# EAGLE board starduino (EAGLE 6.5.0), part 1 of 2
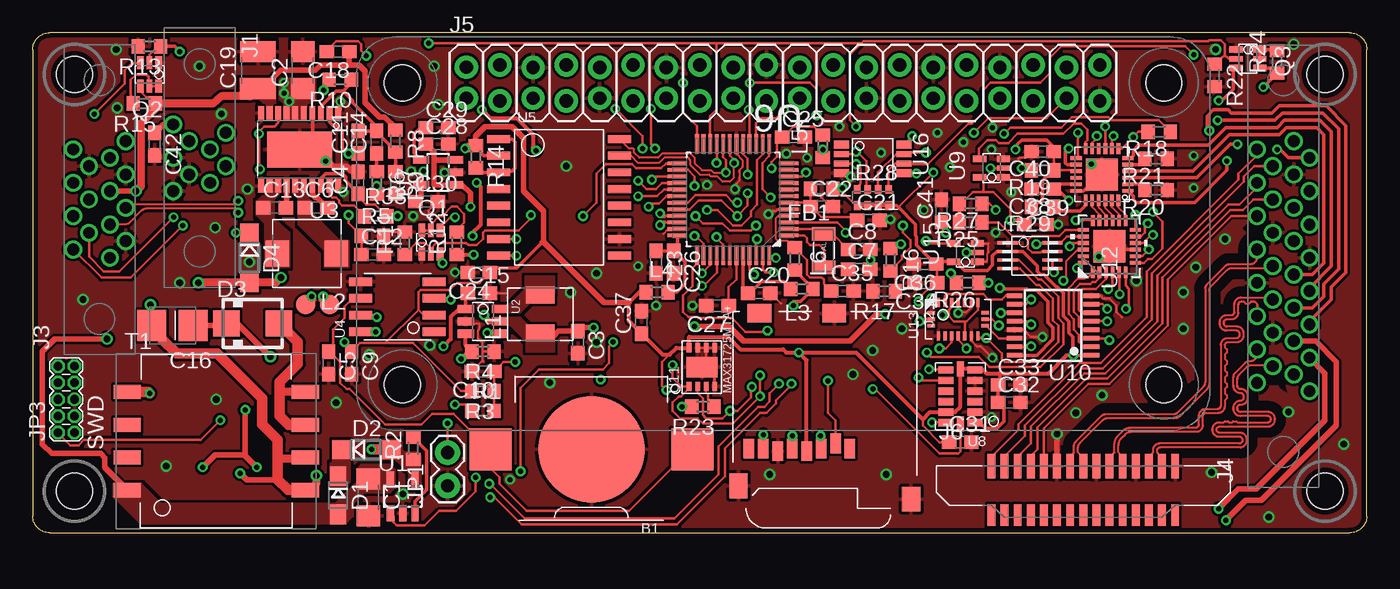
[diagram p2: board, top side]
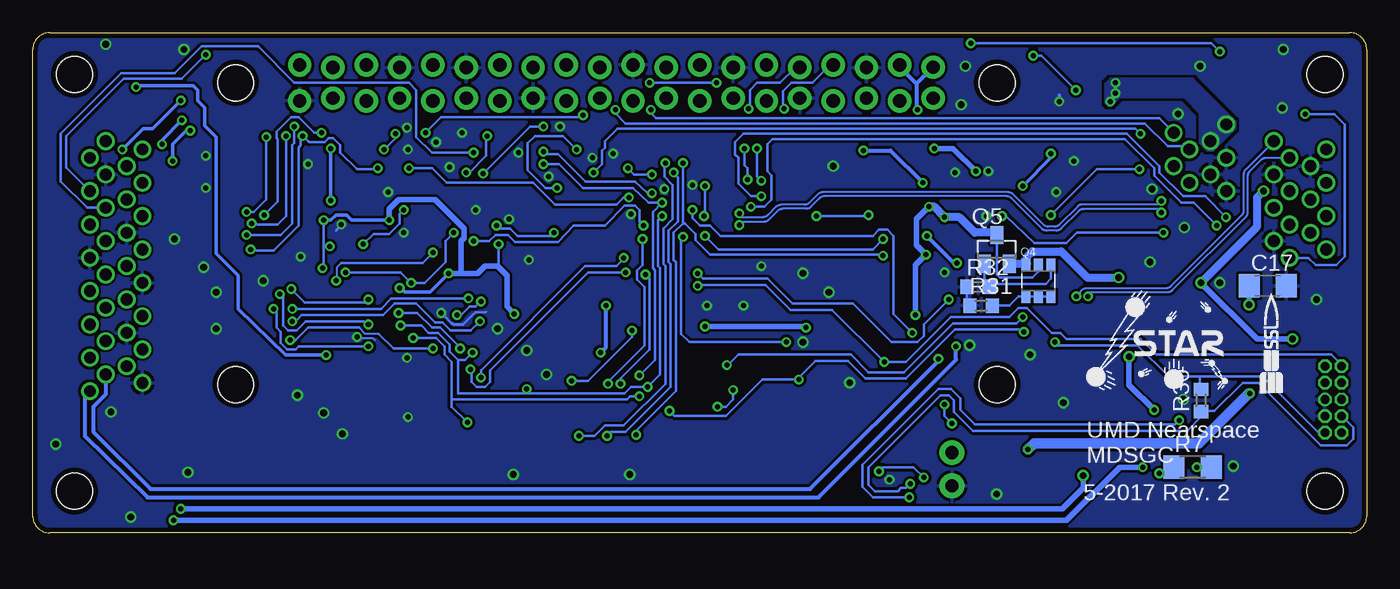
[diagram p3: board, bottom side, seen from below]

Size 101.6 x 38.1 mm. Coordinates in mm from the lower left corner, seen from the top.
Outline: 1.27,0 100.33,0 arc90 101.6,1.27 101.6,36.83 arc90 100.33,38.1 1.27,38.1 arc90 0,36.83 0,1.27 arc90 1.27,0
Copper layers (1*16): Top 0.0356mm / dielectric 1.5011mm / Bottom 0.0356mm
Design rules "LaenPCBOrder *": minimum track width 6mil, minimum drill 13mil, track to track 6mil, track to pad 6mil, pad to pad 6mil, via to via 6mil, smd to smd 6mil, copper to edge 15mil, drill to drill 6mil, minimum pad ring 7mil, minimum via ring 7mil, stop-mask expansion 4mil, vias tented up to drill 20mil, thermal gap 10mil
Net classes: 0 default: width 0.152 mm, drill 0.381 mm, clearance 0.152 mm; 1 PWR_SIG: width 0.203 mm, drill 0.381 mm, clearance 0.152 mm; 2 CTRL_SIG: width 0.203 mm, drill 0.381 mm, clearance 0.152 mm; 3 DIFF_PAIR: width 0.152 mm, drill 0.33 mm, clearance 0.152 mm
Holes 2.75 mm at 3.17,34.92 3.17,3.17 98.42,3.17 98.42,34.92

## Footprints (pad centres in the part's own frame; a part is rotated, then mirrored left to right if it is on the bottom)
CR1025 = smd 3.2 x 3.2: 1 -7.695,0; 2 7.695,0 | smd 8.13 x 8.13: 3 0,0
C1206 = smd 1.6 x 1.8: 1 -1.4,0; 2 1.4,0
C0603 = smd 1.1 x 1: 1 -0.85,0; 2 0.85,0
KEMET_B = smd 2.21 x 2.35: N 1.565,0; P -1.565,0
C1210 = smd 1.6 x 2.7: 1 -1.4,0; 2 1.4,0
SOD323-W = smd 1.5 x 1.2: A 1.45,0; C -1.45,0
SOD123 = smd 1.4 x 1.4: A 1.9,0; C -1.9,0
SMA = smd 2 x 2: A 2,0; C -2,0
0603 = smd 1 x 1.1: 1 -0.85,0; 2 0.85,0
ZKN-9-J30 = drill 0.9: 1 -2.54,-2; 2 -1.27,-0.8; 3 0,-2; 4 1.27,-0.8; 5 2.54,-2; 6 -1.905,2; 7 -0.635,0.8; 8 0.635,2; 9 1.905,0.8
MICROSD_PUSH_PUSH_AMPHENOL = smd 0.8 x 1.5: 1 -1.915,2.95; 2 -0.815,2.55; 3 0.285,2.95; 4 1.385,3.15; 5 2.485,2.95; 6 3.585,3.15; 7 4.685,2.95; 8 5.785,2.95 | smd 1.8 x 1.4: CD1 4.975,-7.35; G3 -0.725,-7.35 | smd 1.4 x 1.9: G1 -6.575,6.8; G2 6.575,5.8
ZKN-15-J30 = drill 0.9: 1 -4.445,-0.8; 2 -3.175,-2; 3 -1.905,-0.8; 4 -0.635,-2; 5 0.635,-0.8; 6 1.905,-2; 7 3.175,-0.8; 8 4.445,-2; 9 -3.81,2; 10 -2.54,0.8; 11 -1.27,2; 12 0,0.8; 13 1.27,2; 14 2.54,0.8; 15 3.81,2
ZKN-31-J30 = drill 0.9: 1 -9.525,-2; 2 -8.255,-0.8; 3 -6.985,-2; 4 -5.715,-0.8; 5 -4.445,-2; 6 -3.175,-0.8; 7 -1.905,-2; 8 -0.635,-0.8; 9 0.635,-2; 10 1.905,-0.8; 11 3.175,-2; 12 4.445,-0.8; 13 5.715,-2; 14 6.985,-0.8; 15 8.255,-2; 16 9.525,-0.8; 17 -8.89,2; 18 -7.62,0.8; 19 -6.35,2; 20 -5.08,0.8; 21 -3.81,2; 22 -2.54,0.8; 23 -1.27,2; 24 0,0.8; 25 1.27,2; 26 2.54,0.8; 27 3.81,2; 28 5.08,0.8; 29 6.35,2; 30 7.62,0.8; 31 8.89,2
2X20-OFFSET = drill 1.016 pad 1.778: 1 -24.13,-1.168; 2 -24.13,1.194; 3 -21.59,-1.372; 4 -21.59,1.372; 5 -19.05,-1.168; 6 -19.05,1.168; 7 -16.51,-1.372; 8 -16.51,1.372; 9 -13.97,-1.168; 10 -13.97,1.168; 11 -11.43,-1.372; 12 -11.43,1.372; 13 -8.89,-1.168; 14 -8.89,1.168; 15 -6.35,-1.372; 16 -6.35,1.372; 17 -3.81,-1.168; 18 -3.81,1.168; 19 -1.27,-1.372; 20 -1.27,1.372; 21 1.27,-1.168; 22 1.27,1.168; 23 3.81,-1.372; 24 3.81,1.372; 25 6.35,-1.168; 26 6.35,1.168; 27 8.89,-1.372; 28 8.89,1.372; 29 11.43,-1.168; 30 11.43,1.168; 31 13.97,-1.372; 32 13.97,1.372; 33 16.51,-1.168; 34 16.51,1.168; 35 19.05,-1.372; 36 19.05,1.372; 37 21.59,-1.168; 38 21.59,1.168; 39 24.13,-1.372; 40 24.13,1.372 | hole 2.75: -29,0; 29,0; -29,-23; 29,-23
1-1734248-5 = smd 0.6 x 1.85: 1 7,0; 2 6,0; 3 5,0; 4 4,0; 5 3,0; 6 2,0; 7 1,0; 8 0,0; 9 -1,0; 10 -2,0; 11 -3,0; 12 -4,0; 13 -5,0; 14 -6,0; 15 -7,0 | smd 0.6 x 1.65: A1 7,-3.725; A2 6,-3.725; A3 5,-3.725; A4 4,-3.725; A5 3,-3.725; A6 2,-3.725; A7 1,-3.725; A8 0,-3.725; A9 -1,-3.725; A10 -2,-3.725; A11 -3,-3.725; A12 -4,-3.725; A13 -5,-3.725; A14 -6,-3.725; A15 -7,-3.725
1X02 = drill 1.016 pad 1.88: 1 0,0; 2 2.54,0
2X5/90-50MIL = drill 0.66 pad 1.016 octagon: 1 -2.54,-0.635; 2 -2.54,0.635; 3 -1.27,-0.635; 4 -1.27,0.635; 5 0,-0.635; 6 0,0.635; 7 1.27,-0.635; 8 1.27,0.635; 9 2.54,-0.635; 10 2.54,0.635
VLF504012MT(TDK) = smd 1.3 x 2.2: P$1 -1.45,0; P$2 1.45,0
SRP5030 = smd 1.8 x 2: P$1 -2.25,0; P$2 2.25,0
SC70 = smd 0.5 x 1: 1 -0.7,-0.9; 3 0.7,-0.9; 4 0.7,0.9; 6 -0.7,0.9 | smd 0.4 x 1: 2 0,-0.9; 5 0,0.9
SOT-26 = smd 0.7 x 1: 1 -0.95,-1.2; 2 0,-1.2; 3 0.95,-1.2; 4 0.95,1.2; 5 0,1.2; 6 -0.95,1.2
SOT23 = smd 1 x 1.4: 1 -0.95,-1.1; 2 0.95,-1.1; 3 0,1.1
R0603 = smd 1 x 1.1: 1 -0.85,0; 2 0.85,0
R1206 = smd 1.6 x 1.803: 1 -1.422,0; 2 1.422,0
0603-ARV = smd 0.5 x 0.65: 1 -1.2,-0.625; 2 -0.4,-0.625; 3 0.4,-0.625; 4 1.2,-0.625; 5 1.2,0.625; 6 0.4,0.625; 7 -0.4,0.625; 8 -1.2,0.625
750313972 = smd 2.08 x 1.07: 1 -6.78,-3.735; 2 -6.78,-1.245; 3 -6.78,1.245; 4 -6.78,3.735; 5 6.78,3.735; 6 6.78,1.245; 7 6.78,-1.245; 8 6.78,-3.735
TP-1.5MM = smd 1.5 x 1.5: P$1 0,0
SOT23-5L = smd 0.55 x 1.2: 1 -0.95,-1.3; 2 0,-1.3; 3 0.95,-1.3; 4 0.95,1.3; 5 -0.95,1.3
SOT23-6 = smd 0.62 x 1.23: 1 -0.95,-1.31; 2 0,-1.31; 3 0.95,-1.31; 4 0.95,1.31; 5 0,1.31; 6 -0.95,1.31
TSSOP20 = smd 0.45 x 1.05: 1 -2.925,-2.775; 2 -2.275,-2.775; 3 -1.625,-2.775; 4 -0.975,-2.775; 5 -0.325,-2.775; 6 0.325,-2.775; 7 0.975,-2.775; 8 1.625,-2.775; 9 2.275,-2.775; 10 2.925,-2.775; 11 2.925,2.775; 12 2.275,2.775; 13 1.625,2.775; 14 0.975,2.775; 15 0.325,2.775; 16 -0.325,2.775; 17 -0.975,2.775; 18 -1.625,2.775; 19 -2.275,2.775; 20 -2.925,2.775 | smd 4.95 x 2.74: PAD 0,0
SOIC-8 = smd 0.65 x 1.75: 1 -1.905,-2.8; 2 -0.635,-2.8; 3 0.635,-2.8; 4 1.905,-2.8; 5 1.905,2.8; 6 0.635,2.8; 7 -0.635,2.8; 8 -1.905,2.8
SOP2-16 = smd 0.6 x 1.75: 1 -4.445,-4.6; 2 -3.175,-4.6; 3 -1.905,-4.6; 4 -0.635,-4.6; 5 0.635,-4.6; 6 1.905,-4.6; 7 3.175,-4.6; 8 4.445,-4.6; 9 4.445,4.6; 10 3.175,4.6; 11 1.905,4.6; 12 0.635,4.6; 13 -0.635,4.6; 14 -1.905,4.6; 15 -3.175,4.6; 16 -4.445,4.6
48-TQFP = smd 1.473 x 0.279: 1 -4.242,2.743; 2 -4.242,2.261; 3 -4.242,1.753; 4 -4.242,1.245; 5 -4.242,0.762; 6 -4.242,0.254; 7 -4.242,-0.254; 8 -4.242,-0.762; 9 -4.242,-1.245; 10 -4.242,-1.753; 11 -4.242,-2.261; 12 -4.242,-2.743; 25 4.242,-2.743; 26 4.242,-2.261; 27 4.242,-1.753; 28 4.242,-1.245; 29 4.242,-0.762; 30 4.242,-0.254; 31 4.242,0.254; 32 4.242,0.762; 33 4.242,1.245; 34 4.242,1.753; 35 4.242,2.261; 36 4.242,2.743 | smd 0.279 x 1.473: 13 -2.743,-4.242; 14 -2.261,-4.242; 15 -1.753,-4.242; 16 -1.245,-4.242; 17 -0.762,-4.242; 18 -0.254,-4.242; 19 0.254,-4.242; 20 0.762,-4.242; 21 1.245,-4.242; 22 1.753,-4.242; 23 2.261,-4.242; 24 2.743,-4.242; 37 2.743,4.242; 38 2.261,4.242; 39 1.753,4.242; 40 1.245,4.242; 41 0.762,4.242; 42 0.254,4.242; 43 -0.254,4.242; 44 -0.762,4.242; 45 -1.245,4.242; 46 -1.753,4.242; 47 -2.261,4.242; 48 -2.743,4.242
LGA-14 = smd 1.145 x 0.55: 1 -1.097,2; 2 -1.097,1.2; 3 -1.097,0.4; 4 -1.097,-0.4; 5 -1.097,-1.2; 6 -1.097,-2; 8 1.097,-2; 9 1.097,-1.2; 10 1.097,-0.4; 11 1.097,0.4; 12 1.097,1.2; 13 1.097,2 | smd 0.55 x 1.145: 7 0,-2.098; 14 0,2.098
SC-70-5 = smd 0.5 x 1: 1 -0.7,-0.9; 3 0.7,-0.9; 4 0.7,0.9; 5 -0.7,0.9 | smd 0.4 x 1: 2 0,-0.9
TSSOP16 = smd 0.35 x 1.2: 1 -2.275,-2.925; 2 -1.625,-2.925; 3 -0.975,-2.925; 4 -0.325,-2.925; 5 0.325,-2.925; 6 0.975,-2.925; 7 1.625,-2.925; 8 2.275,-2.925; 9 2.275,2.925; 10 1.625,2.925; 11 0.975,2.925; 12 0.325,2.925; 13 -0.325,2.925; 14 -0.975,2.925; 15 -1.625,2.925; 16 -2.275,2.925
DFN-8 = smd 0.7 x 0.35: 1 -1.475,0.975; 2 -1.475,0.325; 3 -1.475,-0.325; 4 -1.475,-0.975; 5 1.475,-0.975; 6 1.475,-0.325; 7 1.475,0.325; 8 1.475,0.975 | smd 1.58 x 2.35: 9 0,0
RTW24_2P45X2P45 = smd 0.85 x 0.28: 1 -1.975,1.25; 2 -1.975,0.75; 3 -1.975,0.25; 4 -1.975,-0.25; 5 -1.975,-0.75; 6 -1.975,-1.25; 13 1.975,-1.25; 14 1.975,-0.75; 15 1.975,-0.25; 16 1.975,0.25; 17 1.975,0.75; 18 1.975,1.25 | smd 0.28 x 0.85: 7 -1.25,-1.975; 8 -0.75,-1.975; 9 -0.25,-1.975; 10 0.25,-1.975; 11 0.75,-1.975; 12 1.25,-1.975; 19 1.25,1.975; 20 0.75,1.975; 21 0.25,1.975; 22 -0.25,1.975; 23 -0.75,1.975; 24 -1.25,1.975 | smd 2.45 x 2.45: 25 0,0
LGA-20 = smd 0.675 x 0.25: 1 1.262,1.5; 2 1.262,1; 3 1.262,0.5; 4 1.262,0; 5 1.262,-0.5; 6 1.262,-1; 7 1.262,-1.5; 11 -1.262,-1.5; 12 -1.262,-1; 13 -1.262,-0.5; 14 -1.262,0; 15 -1.262,0.5; 16 -1.262,1; 17 -1.262,1.5 | smd 0.25 x 0.55: 8 0.5,-2.05; 9 0,-2.05; 10 -0.5,-2.05; 18 -0.5,2.05; 19 0,2.05; 20 0.5,2.05
VQFN6 = smd 0.85 x 0.28: 1 -1.975,1.25; 2 -1.975,0.75; 3 -1.975,0.25; 4 -1.975,-0.25; 5 -1.975,-0.75; 6 -1.975,-1.25; 13 1.975,-1.25; 14 1.975,-0.75; 15 1.975,-0.25; 16 1.975,0.25; 17 1.975,0.75; 18 1.975,1.25 | smd 0.28 x 0.85: 7 -1.25,-1.975; 8 -0.75,-1.975; 9 -0.25,-1.975; 10 0.25,-1.975; 11 0.75,-1.975; 12 1.25,-1.975; 19 1.25,1.975; 20 0.75,1.975; 21 0.25,1.975; 22 -0.25,1.975; 23 -0.75,1.975; 24 -1.25,1.975 | smd 2.45 x 2.45: PPAD 0,0
TSSOP8 = smd 0.6 x 1.15: P$1 -1.087,-2.375; P$4 1.087,-2.375; P$5 1.087,2.375; P$8 -1.087,2.375 | smd 0.45 x 1.15: P$2 -0.362,-2.375; P$3 0.362,-2.375; P$6 0.362,2.375; P$7 -0.362,2.375
SSOP8 = smd 0.25 x 1.55: 1 -0.975,-1.7; 2 -0.325,-1.7; 3 0.325,-1.7; 4 0.975,-1.7; 5 0.975,1.7; 6 0.325,1.7; 7 -0.325,1.7; 8 -0.975,1.7
2-SMD = smd 1 x 1.8: P1 -1.275,0; P2 1.275,0

## Placement (x,y rotation side)
B1  CR1025  [CR1025]  42.55,6.35 180 top
C1  10uF  [C1206]  25.56,2.7 270 top
C2  22uF  [C1206]  20.56,35.24 90 top
C3  1uF  [C0603]  41.51,14.53 270 top
C4  1uF  [C0603]  24.77,26.67 90 top
C5  1nF  [C0603]  22.54,12.94 270 top
C6  100nF  [C0603]  21.59,24.77 0 top
C7  6.8pF  [C0603]  62.94,20.08 0 top
C8  6.8pF  [C0603]  62.94,21.59 0 top
C9  100nF  [C0603]  24.29,12.94 270 top
C10  100nF  [C0603]  34.29,12.3 180 top
C11  10pF  [C0603]  24.77,29.77 90 top
C12  47pF  [C0603]  25.88,21.19 0 top
C13  100nF  [C0603]  18.41,24.77 0 top
C14  680pF  [C0603]  26.19,29.77 90 top
C15  1uF  [C0603]  33.97,18.26 0 top
C16  4.7uF  [KEMET_B]  10.64,15.8 180 top
C17  3.3nF  [C1206]  7.54,18.81 0 bottom
C18  47pF  [C0603]  23.26,36.67 180 top
C19  47uF  [C1210]  17.14,35.24 90 top
C20  10uF  [C0603]  55.32,18.26 0 top
C21  10uF  [C0603]  63.66,23.81 0 top
C22  100nF  [C0603]  60.09,24.84 0 top
C23  100nF  [C0603]  47.47,20.64 270 top
C24  100nF  [C0603]  33.97,19.84 180 top
C25  100nF  [C0603]  57.94,30.16 0 top
C26  100nF  [C0603]  48.82,20.64 270 top
C27  1uF  [C0603]  52.15,17.3 180 top
C28  1uF  [C0603]  30.8,29.61 0 top
C29  100nF  [C0603]  30.8,30.88 0 top
C30  2.2uF  [C0603]  30,25.24 0 top
C31  10uF  [C0603]  70.64,6.91 0 top
C32  100nF  [C0603]  74.37,9.92 0 top
C33  100nF  [C0603]  74.37,11.27 0 top
C34  100nF  [C0603]  68.02,19.05 180 top
C35  100nF  [C0603]  61.67,18.41 0 top
C36  100nF  [C0603]  67.94,20.48 180 top
C37  100nF  [C0603]  46.35,16.03 90 top
C38  2.2uF  [C0603]  76.91,26.19 180 top
C39  10uF  [C0603]  76.36,23.5 0 top
C40  100nF  [C0603]  76.91,29.05 180 top
C41  100pF  [C0603]  69.22,24.53 90 top
C42  1uF  [C0603]  9.29,29.61 270 top
D1  CMDZ5248B  [SOD323-W]  23.26,2.86 270 top
D2  CMHD4448  [SOD123]  25.4,6.35 0 top
D3  STPS1150  [SMA]  16.75,15.95 0 top
D4  B0520LW-7-F  [SOD123]  16.51,20.95 270 top
FB1  BLM18KG221BH1D  [0603]  60.09,26.19 180 top
J1  J30J-9J30  [ZKN-9-J30]  12.7,28.57 270 top
J2  MICRO_SD  [MICROSD_PUSH_PUSH_AMPHENOL]  60.33,9.37 180 top
J3  J30J-15J30  [ZKN-15-J30]  5.08,25.4 90 top
J4  J30J-31J30  [ZKN-31-J30]  95.25,20.32 90 top
J5  RPI-ZERO  [2X20-OFFSET]  57.15,34.29 0 top
J6  RPI-CSI  [1-1734248-5]  80.01,5.08 0 top
JP1  [1X02]  31.59,3.57 90 top
JP3  [2X5/90-50MIL]  2.54,10.16 90 top
L1  22uH  [VLF504012MT(TDK)]  38.66,16.67 90 top
L2  4.7uH  [SRP5030]  20.88,21.27 180 top
L3  10uH  [0603]  58.58,18.57 180 top
L4  10uH  [0603]  47.55,18.34 0 top
L5  10uH  [0603]  60.17,29.45 90 top
L6  10uH  [0603]  58.02,20.88 270 top
Q1  BSS8402DW  [SC70]  30.32,22.15 0 top
Q2  BSS8402DW  [SC70]  8.89,34.92 180 top
Q3  BSS8402DW  [SC70]  92.55,36.12 270 top
Q4  DMMT5401  [SOT-26]  25,19.21 0 bottom
Q5  DMG2305UX  [SOT23]  28.18,21.59 0 bottom
R1  330  [R0603]  34.29,9.29 0 top
R2  130k  [R0603]  28.97,6.43 90 top
R3  10k  [R0603]  34.29,10.79 180 top
R4  6.2  [R0603]  34.29,13.81 180 top
R5  33k  [R0603]  25.88,22.62 0 top
R6  33k  [R0603]  26.19,26.67 270 top
R7  1.5k  [R1206]  13.26,5 0 bottom
R8  845k  [R0603]  27.62,29.84 270 top
R9  158k  [R0603]  27.62,26.67 270 top
R10  10k  [R0603]  23.42,34.53 180 top
R11  100k  [R0603]  28.34,22.07 90 top
R12  191k  [R0603]  32.31,22.07 90 top
R13  100k  [R0603]  8.89,37.07 180 top
R14  4.7k  [R0603]  33.73,28.65 270 top
R15  191k  [R0603]  8.49,32.7 180 top
R16  3.6k  [R0603]  65.33,20.8 270 top
R17  6.8k  [R0603]  64.85,18.41 180 top
R18  10k  [R0603]  85.8,30.56 180 top
R19  10k  [R0603]  76.91,27.62 180 top
R20  1.05  [R0603]  85.57,26.11 180 top
R21  1.05  [R0603]  85.57,28.5 180 top
R22  100k  [R0603]  90.01,34.85 270 top
R23  4.7k  [R0603]  51.04,9.6 180 top
R24  191k  [R0603]  94.77,35.88 90 top
R25  4.7k  [R0603]  71.44,23.65 180 top
R26  220k  [R0603]  71.2,19.05 180 top
R27  4.7k  [R0603]  71.44,25.08 180 top
R28  4.7k  [0603-ARV]  63.98,25.56 180 top
R29  10k  [R0603]  76.91,24.84 180 top
R30  10k  [R0603]  12.62,10.08 90 bottom
R31  10k  [R0603]  29.37,17.3 0 bottom
R32  47k  [R0603]  29.61,18.73 0 bottom
R33  1M  [R0603]  26.11,24.13 0 top
T1  750313975  [750313972]  13.97,6.99 0 top
TP1  TESTPOINT1.5MM  [TP-1.5MM]  22.62,17.38 180 top
TP2  TESTPOINT1.5MM  [TP-1.5MM]  20.8,17.38 180 top
U1  LT8301  [SOT23-5L]  28.18,2.78 0 top
U2  LT3465/A  [SOT23-6]  34.29,16.11 270 top
U3  LTC3112FE  [TSSOP20]  20.32,29.21 180 top
U4  DS3231MZ+  [SOIC-8]  27.78,17.22 90 top
U5  MT25QL01GBBB8ESF-0AAT  [SOP2-16]  40.08,25.56 270 top
U6  ATSAMD21G18  [48-TQFP]  53.34,25.4 180 top
U7  MIC5319  [SOT23-5L]  30.88,27.46 90 top
U8  ADXL375BCCZ  [LGA-14]  70.64,10.4 180 top
U9  MC74VHC1GT125  [SC-70-5]  73.03,27.78 90 top
U10  MC14504BDTG  [TSSOP16]  77.71,15.8 90 top
U11  MAX31725MTA+  [DFN-8]  50.96,12.62 90 top
U12  TCA9535_RTW_24  [RTW24_2P45X2P45]  81.99,21.83 90 top
U13  BMX055  [LGA-20]  70.48,16.27 90 top
U14  DRV8846RGER  [VQFN6]  81.44,27.3 180 top
U15  MC74VHC1GT125  [SC-70-5]  71.04,21.35 90 top
U16  PCA9515A  [TSSOP8]  63.98,28.5 270 top
U17  PCA9306DCT  [SSOP8]  75.96,21.11 270 top
U$1  STAR  [STAR_.3IN]  21.35,10.87 0 bottom
U$2  SSL.3IN_SILK  [SSL_SILK_.3IN]  8.49,10.64 0 bottom
XTAL1  ABS07AIG-32.768KHZ-1-T  [2-SMD]  60.25,21.51 270 top